# Altium project wifi_lamp_01.PrjPcb
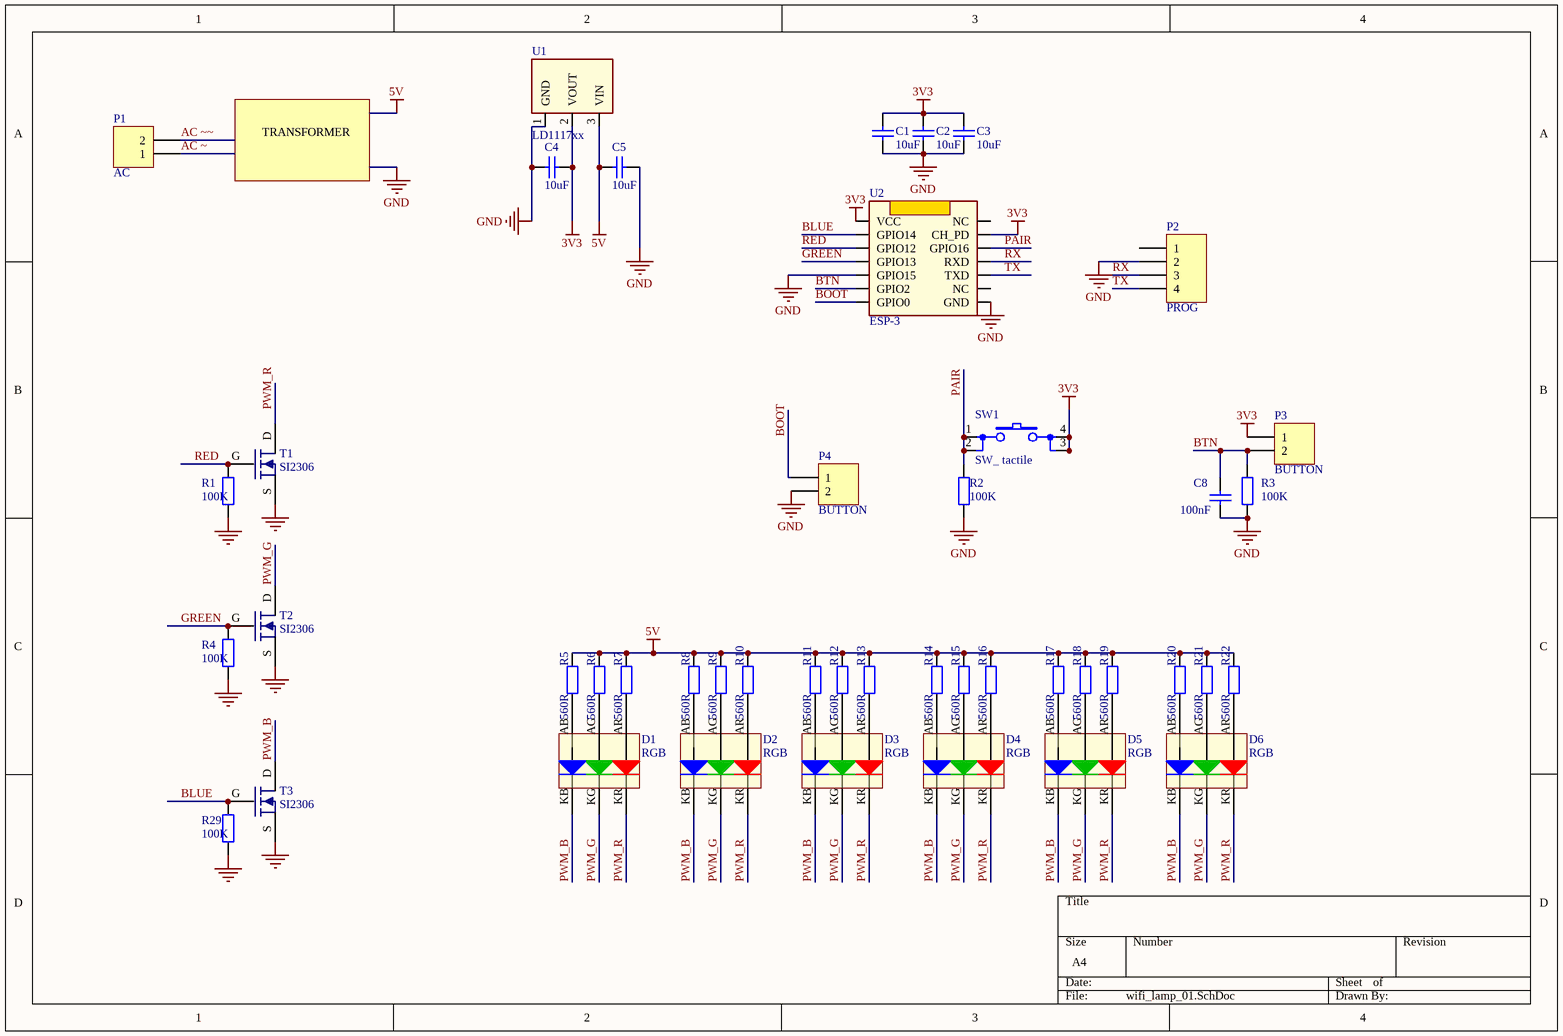
[diagram p0: wifi_lamp_01.SchDoc]
1 sheet, 45 parts. Net scope: global (net labels, ports and power ports of the same name join across sheets).
Board file: wifi_lamp_01.PcbDoc

## Sheet wifi_lamp_01.SchDoc
size A4

### Parts
C1  10uF  [FP_1206_CAP_085]
C2  10uF  [FP_1206_CAP_085]
C3  10uF  [FP_1206_CAP_085]
C4  10uF  [FP_1206_CAP_085]
C5  10uF  [FP_1206_CAP_085]
C8  100nF  [FP_0603_CAP_080]
D1  RGB  [RGB_LED_5.0x5.0mm]
D2  RGB  [RGB_LED_5.0x5.0mm]
D3  RGB  [RGB_LED_5.0x5.0mm]
D4  RGB  [RGB_LED_5.0x5.0mm]
D5  RGB  [RGB_LED_5.0x5.0mm]
D6  RGB  [RGB_LED_5.0x5.0mm]
P1  AC  [Sorkapocs 2P 5mm]
P2  PROG  [HDR1X4]
P3  BUTTON  [HDR1X2]
P4  BUTTON  [HDR1X2]
R1  100K  [FP_0603_RES]
R2  100K  [FP_0603_RES]
R3  100K  [FP_0603_RES]
R4  100K  [FP_0603_RES]
R5  560R  [FP_0603_RES]
R6  560R  [FP_0603_RES]
R7  560R  [FP_0603_RES]
R8  560R  [FP_0603_RES]
R9  560R  [FP_0603_RES]
R10  560R  [FP_0603_RES]
R11  560R  [FP_0603_RES]
R12  560R  [FP_0603_RES]
R13  560R  [FP_0603_RES]
R14  560R  [FP_0603_RES]
R15  560R  [FP_0603_RES]
R16  560R  [FP_0603_RES]
R17  560R  [FP_0603_RES]
R18  560R  [FP_0603_RES]
R19  560R  [FP_0603_RES]
R20  560R  [FP_0603_RES]
R21  560R  [FP_0603_RES]
R22  560R  [FP_0603_RES]
R29  100K  [FP_0603_RES]
SW1  SW_ tactile  [FP_TACTBTN]
T1  SI2306  [FET_SOT23]
T2  SI2306  [FET_SOT23]
T3  SI2306  [FET_SOT23]
U1  LD1117xx  [SUPPLY_SOT223]
U2  ESP-3  [ESP_3]

### Nets
3V3: C1.2 C2.2 C3.2 C4.2 P3.1 SW1.3 SW1.4 U1.2(VOUT) U2.1(VCC) U2.13(CH_PD)
5V: C5.1 R5.2 R6.2 R7.2 R8.2 R9.2 R10.2 R11.2 R12.2 R13.2 R14.2 R15.2 R16.2 R17.2 R18.2 R19.2 R20.2 R21.2 R22.2 U1.3(VIN)
GND: C1.1 C2.1 C3.1 C4.1 C5.2 C8.2 P2.2 P4.2 R1.1 R2.2 R3.1 R4.1 R29.1 T1.S T2.S T3.S U1.1(GND) U2.5(GPIO15) U2.8(GND)
AC ~: P1.1
AC ~~: P1.2
BLUE: R29.2 T3.G U2.2(GPIO14)
BOOT: P4.1 U2.7(GPIO0)
BTN: C8.1 P3.2 R3.2 U2.6(GPIO2)
GREEN: R4.2 T2.G U2.4(GPIO13)
PAIR: R2.1 SW1.1 SW1.2 U2.12(GPIO16)
PWM_B: D1.KB(R) D2.KB(R) D3.KB(R) D4.KB(R) D5.KB(R) D6.KB(R) T3.D
PWM_G: D1.KG(G) D2.KG(G) D3.KG(G) D4.KG(G) D5.KG(G) D6.KG(G) T2.D
PWM_R: D1.KR(B) D2.KR(B) D3.KR(B) D4.KR(B) D5.KR(B) D6.KR(B) T1.D
RED: R1.2 T1.G U2.3(GPIO12)
RX: P2.3 U2.11(RXD)
TX: P2.4 U2.10(TXD)
NetD1_AB: D1.AB(A) R5.1
NetD1_AG: D1.AG(A) R6.1
NetD1_AR: D1.AR(A) R7.1
NetD2_AB: D2.AB(A) R8.1
NetD2_AG: D2.AG(A) R9.1
NetD2_AR: D2.AR(A) R10.1
NetD3_AB: D3.AB(A) R11.1
NetD3_AG: D3.AG(A) R12.1
NetD3_AR: D3.AR(A) R13.1
NetD4_AB: D4.AB(A) R14.1
NetD4_AG: D4.AG(A) R15.1
NetD4_AR: D4.AR(A) R16.1
NetD5_AB: D5.AB(A) R17.1
NetD5_AG: D5.AG(A) R18.1
NetD5_AR: D5.AR(A) R19.1
NetD6_AB: D6.AB(A) R20.1
NetD6_AG: D6.AG(A) R21.1
NetD6_AR: D6.AR(A) R22.1

Not connected (* = marked no-connect by the designer): P2 1; U2 9(NC) 14(NC)

### Notes on the sheet
- TRANSFORMER

### Library data of the parts
C1-C3 = Cap: Capacitor; Value: 100nF; Tûrés: 20% X7R; Order info: TODO; Published: 8-Jun-2000; LatestRevisionDate: 17-Jul-2002; LatestRevisionNote: Re-released for DXP Platform.; PackageReference: RAD-0.3; Publisher: Altium Limited; Order info: 82-07-81
C4 C5 = Cap: Capacitor; Value: 100nF; Tûrés: 20% X7R; Published: 8-Jun-2000; LatestRevisionDate: 17-Jul-2002; LatestRevisionNote: Re-released for DXP Platform.; PackageReference: RAD-0.3; Publisher: Altium Limited; Order info: 82-08-03
C8 = Cap: Capacitor; Order info: L: 82-04-85; Tûrés: 10%; Value: 100nF
D1-D6 = LED_RGB_6_PIN
P1 P3 P4 = Header 2: Header, 2-Pin; LatestRevisionDate: 17-Jul-2002; LatestRevisionNote: Re-released for DXP Platform.; Publisher: Altium Limited
P2 = Header 4: Header, 4-Pin; LatestRevisionDate: 17-Jul-2002; LatestRevisionNote: Re-released for DXP Platform.; Publisher: Altium Limited
R1-R4 R29 = RES: Resistor; Value: 100K; Order info: 81-10-50
R5-R22 = Res3: Resistor; Order info: L: 81-04-19; Tûrés: 5%; Value: 560R
T1-T3 = NMOS: Order info: 86-01-57
U1 = LD1117xx: LD1117xx 3,3V lin reg; Order info: http://hu.mouser.com/ProductDetail/NXP/NX1117C33Z115/?qs=%2fha2pyFadui8%252bOpsKr9N%2fhvfdxjCMx%252bF0NTwqG%252bWOJY%3d
U2 = ESP-3: ESP-3wifi module